# EasyEDA schematic Todesstern.json
TITLE: Todesstern; REV: 1.0; Date: 17.11.2021; Sheet: 1/1; Company: FabLab Lübeck
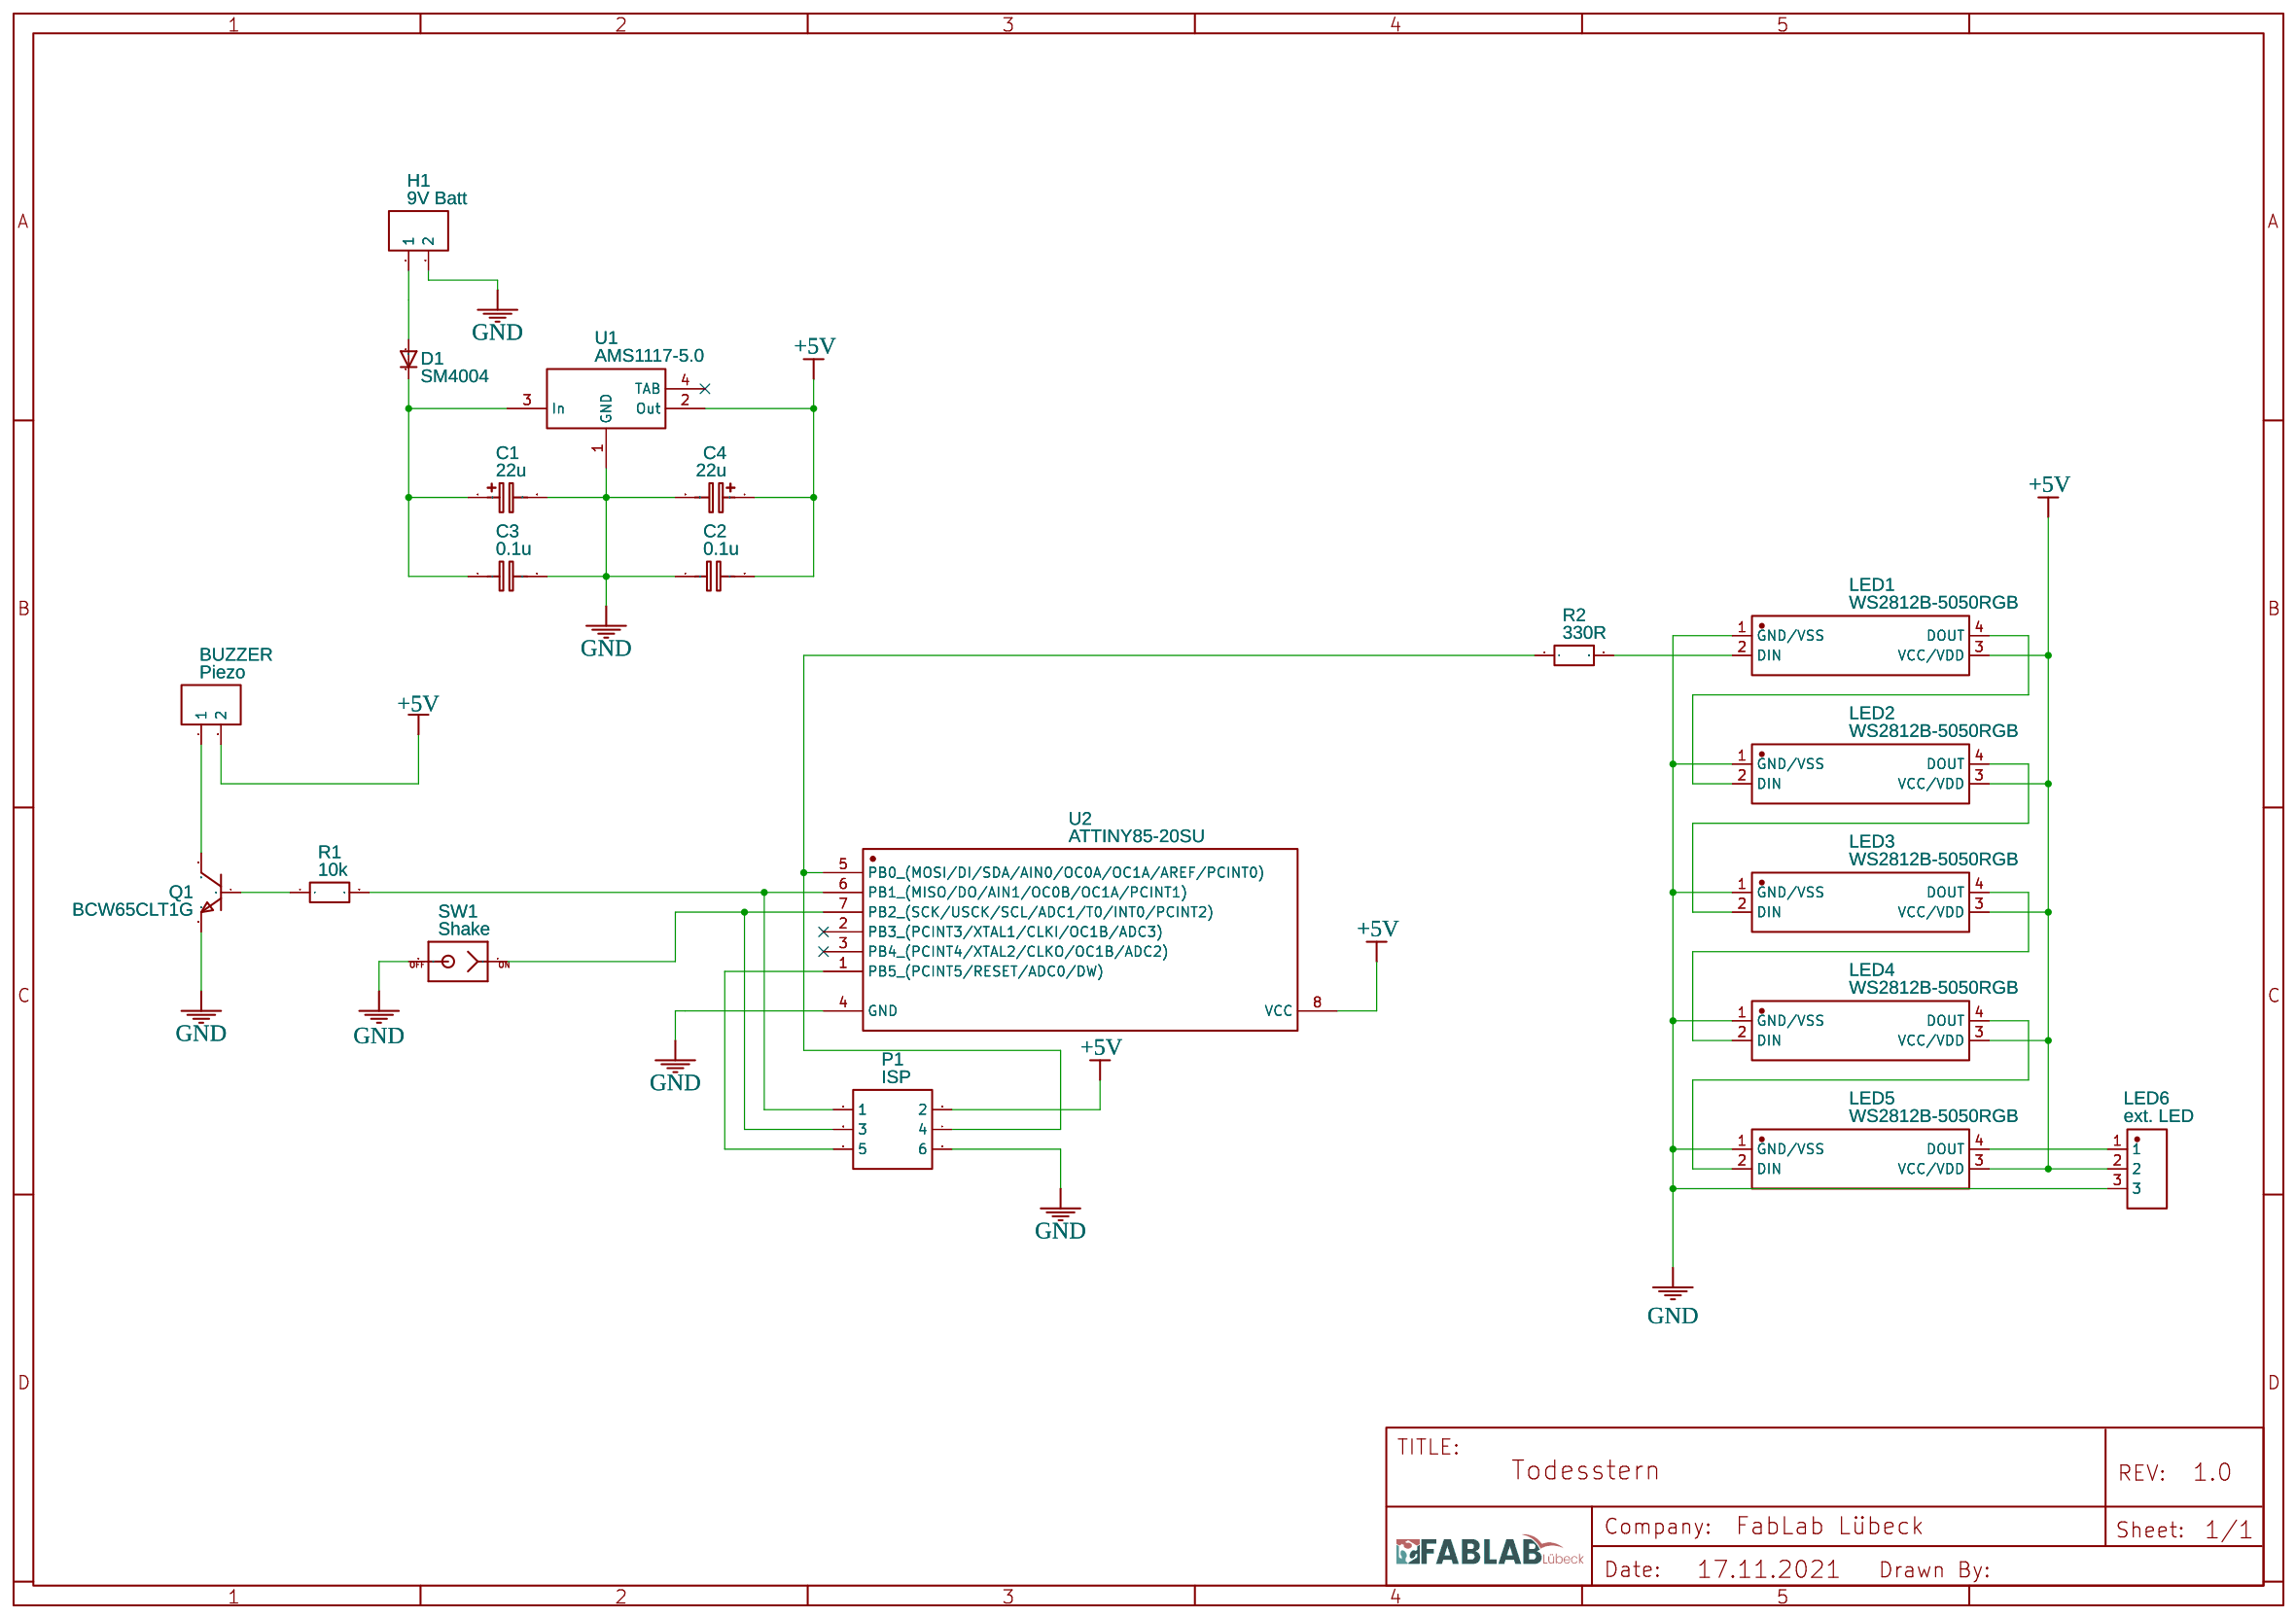
[diagram p0: schematic sheet]

## Parts
BUZZER  Piezo  [HDR-F-2.54_1X2]
C1  22u  [CASE-C_6032]
C2  0.1u  [C0805]
C3  0.1u  [C0805]
C4  22u  [CASE-C_6032]
D1  SM4004  [MELF-MLL41_DO213AB]
H1  9V Batt  [HDR-F-2.54_1X2]
LED1  WS2812B-5050RGB  [LED-SMD_4P-L5.0-W5.0-BR_WS2812B-5050RGB]
LED2  WS2812B-5050RGB  [LED-SMD_4P-L5.0-W5.0-BR_WS2812B-5050RGB]
LED3  WS2812B-5050RGB  [LED-SMD_4P-L5.0-W5.0-BR_WS2812B-5050RGB]
LED4  WS2812B-5050RGB  [LED-SMD_4P-L5.0-W5.0-BR_WS2812B-5050RGB]
LED5  WS2812B-5050RGB  [LED-SMD_4P-L5.0-W5.0-BR_WS2812B-5050RGB]
LED6  ext. LED  [HDR-TH_3P-P2.00-V-M]
P1  ISP  [IDC-TH_6P-P2.54_C11214]
Q1  BCW65CLT1G  [SOT-23-3_L2.9-W1.3-P1.90-LS2.4-BR]
R1  10k  [R0805]
R2  330R  [R0805]
SW1  Shake  [SW2-12.7-12.0X3.6X3.6MM]
U1  AMS1117-5.0  [SOT-223_L6.5-W3.5-P2.30-LS7.0-BR]
U2  ATTINY85-20SU  [SOIC-8_L5.3-W5.3-P1.27-LS8.0-BL]

## Library data of the parts
BUZZER H1 = HDR-F-2.54_1x2: Supplier Part: C49661; Supplier: LCSC; Contributor: LCEDA_Lib
C1 C4 = C_Tan_SMD_C_EU: Contributor: LCEDA_Lib
C2 C3 = C_0805_EU: Contributor: LCEDA_Lib
D1 = SM4004
LED1-LED5 = WS2812B-5050RGB: Supplier: LCSC; Supplier Part: C2838584; Manufacturer: null; JLCPCB Part Class: Extended Part; Contributor: LCSC
LED6 = PZ200-1-03-Z: Supplier: LCSC; Supplier Part: C2905949; Manufacturer: HCTL(华灿天禄); Contributor: LCSC
P1 = HDR-IDC-2.54-2X3P: Supplier: LCSC; Manufacturer: BOOMELE; Manufacturer Part: 2X3 2.54mm IDC Box; image: //image.lceda.cn/szlcsc/C11214.jpg; Supplier Part: C11214
Q1 = BCW65CLT1G: Supplier: LCSC; Supplier Part: C232540; Manufacturer: ON Semicon; Contributor: LCSC; JLCPCB Part Class: Extended Part
R1 R2 = R_0805_EU: Contributor: LCEDA_Lib
SW1 = SW-200D: DIP Tilt Switch;
U1 = AMS1117-5.0: sourceId: HltLFyQwq; Supplier: LCSC; Manufacturer: AMS; Supplier Part: C6187; JLCPCB Part Class: Basic Part
U2 = ATTINY85-20SU: Supplier: LCSC; Manufacturer: MICROCHIP; Supplier Part: C89852; JLCPCB Part Class: Extended Part

## Nets
+5V: BUZZER.2 C2.2 C4.1 LED1.3(VCC/VDD) LED2.3(VCC/VDD) LED3.3(VCC/VDD) LED4.3(VCC/VDD) LED5.3(VCC/VDD) LED6.2 P1.2 U1.2(Out) U2.8(VCC)
GND: C1.2 C2.1 C3.2 C4.2 H1.2 LED1.1(GND/VSS) LED2.1(GND/VSS) LED3.1(GND/VSS) LED4.1(GND/VSS) LED5.1(GND/VSS) LED6.3 P1.6 Q1.2(E) SW1.2 U1.1(GND) U2.4(GND)
Net-(BUZZER-1): BUZZER.1 Q1.3(C)
Net-(C1-1): C1.1 C3.1 D1.C U1.3(In)
Net-(D1-A): D1.A H1.1
Net-(LED1-2): LED1.2(DIN) R2.2
Net-(LED1-4): LED1.4(DOUT) LED2.2(DIN)
Net-(LED2-4): LED2.4(DOUT) LED3.2(DIN)
Net-(LED3-4): LED3.4(DOUT) LED4.2(DIN)
Net-(LED4-4): LED4.4(DOUT) LED5.2(DIN)
Net-(LED5-4): LED5.4(DOUT) LED6.1
Net-(P1-1): P1.1 R1.2 U2.6(PB1 (MISO/DO/AIN1/OC0B/OC1A/PCINT1))
Net-(P1-3): P1.3 SW1.1 U2.7(PB2 (SCK/USCK/SCL/ADC1/T0/INT0/PCINT2))
Net-(P1-4): P1.4 R2.1 U2.5(PB0 (MOSI/DI/SDA/AIN0/OC0A/OC1A/AREF/PCINT0))
Net-(P1-5): P1.5 U2.1(PB5 (PCINT5/RESET/ADC0/DW))
Net-(Q1-1): Q1.1(B) R1.1

Not connected (* = marked no-connect by the designer): U1 4(TAB)*; U2 2(PB3 (PCINT3/XTAL1/CLKI/OC1B/ADC3))* 3(PB4 (PCINT4/XTAL2/CLKO/OC1B/ADC2))*
